# Altium schematic sheet ArduinoUnoShield.SchDoc
size A4
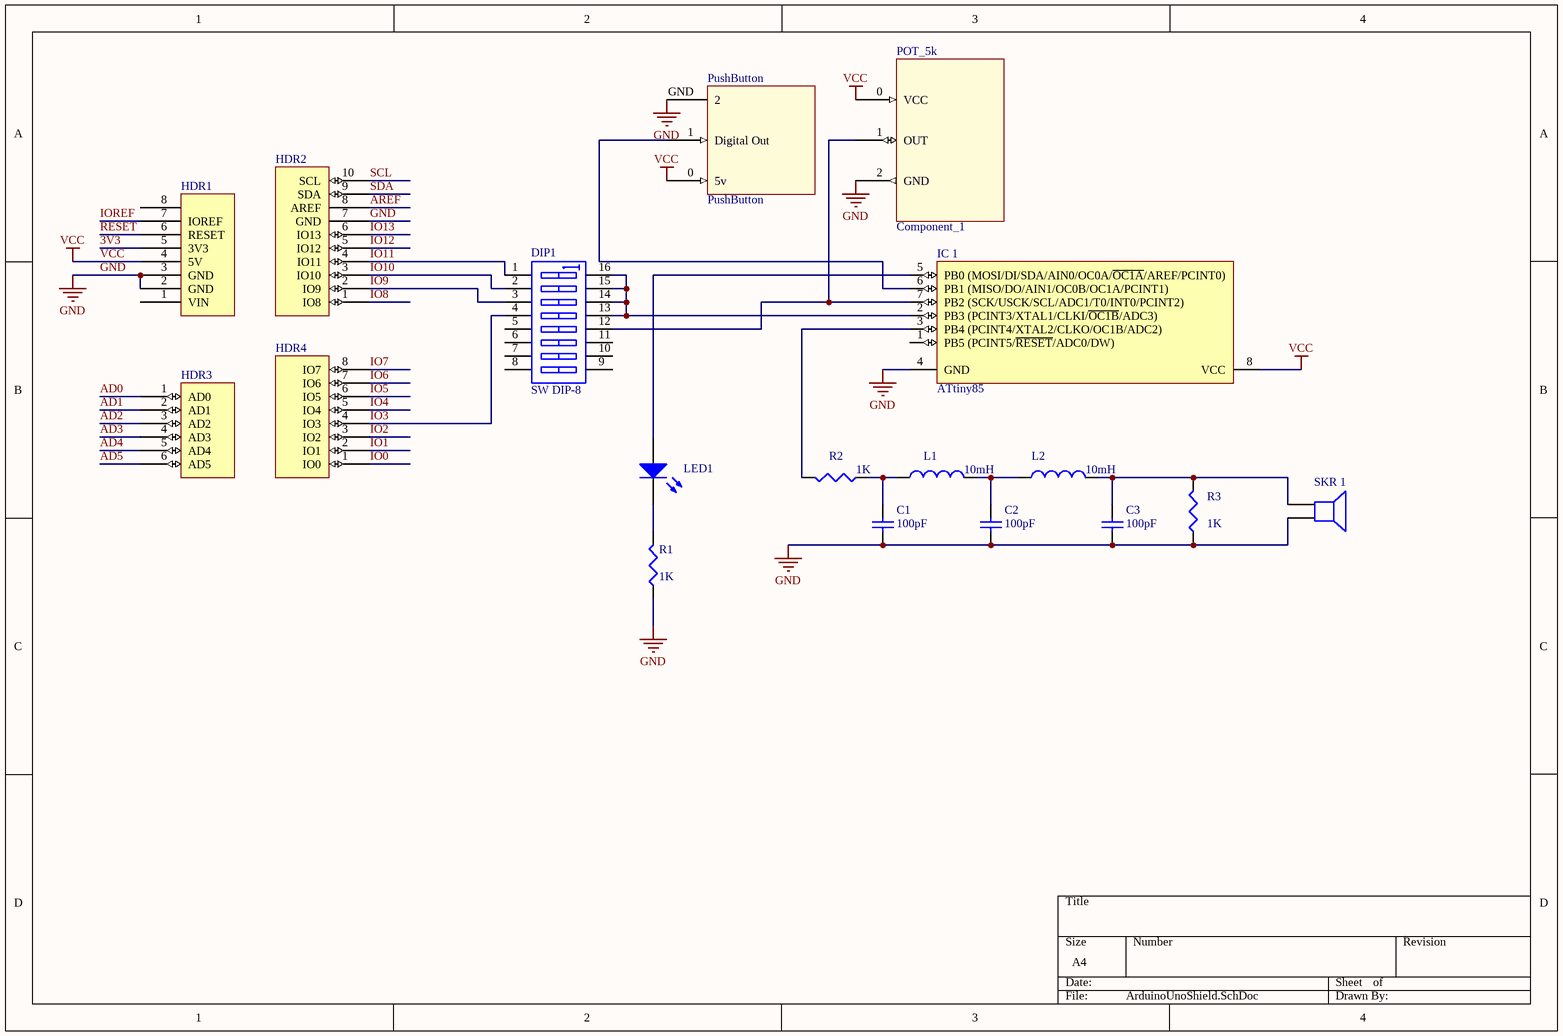
[diagram p0: ArduinoUnoShield.SchDoc]

## Parts
C1  value 100pF  [1608[0603]]  (hidden comment: Cap Semi)
C2  value 100pF  [1608[0603]]  (hidden comment: Cap Semi)
C3  value 100pF  [1608[0603]]  (hidden comment: Cap Semi)
DIP1  SW DIP-8  [DIP_SW_8WAY_SMD]
HDR1  POWER_UNO  [Header 8x1 8.5mm]  (value not drawn)
HDR2  IOH  [Header 10x1 8.5mm]  (value not drawn)
HDR3  AD  [Header 6x1 8.5mm]  (value not drawn)
HDR4  IOL  [Header 8x1 8.5mm]  (value not drawn)
IC_1  ATtiny85  [8P3]
L1  value 10mH  [0603]  (hidden comment: Inductor)
L2  value 10mH  [0603]  (hidden comment: Inductor)
LED1  LED1  [LED-1]  (value not drawn)
POT_5k  Component_1  [PCBComponent_1]
PushButton  PushButton  [PushButtonFrame]
R1  value 1K  [J1-0603]
R2  value 1K  [J1-0603]  (hidden comment: Res3)
R3  value 1K  [J1-0603]  (hidden comment: Res3)
SKR_1  Speaker  [PIN2]  (value not drawn)

## Nets
GND: C1.1 C2.1 C3.1 HDR1.2(GND) HDR1.3(GND) HDR2.7(GND) IC_1.4(GND) POT_5k.2(GND) PushButton.GND(2) R1.1 R3.1 SKR_1.2
VCC: HDR1.4(5V) IC_1.8(VCC) POT_5k.0(VCC) PushButton.0(5v)
3V3: HDR1.5(3V3)
AD0: HDR3.1(AD0)
AD1: HDR3.2(AD1)
AD2: HDR3.3(AD2)
AD3: HDR3.4(AD3)
AD4: HDR3.5(AD4)
AD5: HDR3.6(AD5)
AREF: HDR2.8(AREF)
IO0: HDR4.1(IO0)
IO1: HDR4.2(IO1)
IO2: HDR4.3(IO2)
IO3: DIP1.4(A4) HDR4.4(IO3)
IO4: HDR4.5(IO4)
IO5: HDR4.6(IO5)
IO6: HDR4.7(IO6)
IO7: HDR4.8(IO7)
IO8: HDR2.1(IO8)
IO9: DIP1.3(A3) HDR2.2(IO9)
IO10: DIP1.2(A2) HDR2.3(IO10)
IO11: DIP1.1(A1) HDR2.4(IO11)
IO12: HDR2.5(IO12)
IO13: HDR2.6(IO13)
IOREF: HDR1.7(IOREF)
RESET: HDR1.6(RESET)
SCL: HDR2.10(SCL)
SDA: HDR2.9(SDA)
NetC1_2: C1.2 L1.1 R2.1
NetC2_2: C2.2 L1.2 L2.1
NetC3_2: C3.2 L2.2 R3.2 SKR_1.1
NetDIP1_12: DIP1.12(B5) IC_1.7(PB2_(SCK/USCK/SCL/ADC1/T0/INT0/PCINT2)) POT_5k.1(OUT)
NetDIP1_13: DIP1.13(B4) DIP1.14(B3) DIP1.15(B2) DIP1.16(B1) IC_1.2(PB3_(PCINT3/XTAL1/CLKI/~{OC1B}/ADC3))
NetIC_1_3: IC_1.3(PB4_(PCINT4/XTAL2/CLKO/OC1B/ADC2)) R2.2
NetIC_1_5: IC_1.5(PB0_(MOSI/DI/SDA/AIN0/OC0A/~{OC1A}/AREF/PCINT0)) LED1.1(A)
NetIC_1_6: IC_1.6(PB1_(MISO/DO/AIN1/OC0B/OC1A/PCINT1)) PushButton.1(Digital_Out)
NetLED1_2: LED1.2(K) R1.2

Not connected (* = marked no-connect by the designer): DIP1 5(A5) 6(A6) 7(A7) 8(A8) 9(B8) 10(B7) 11(B6); HDR1 1(VIN) 8; IC_1 1(PB5_(PCINT5/~{RESET}/ADC0/DW))

## Library data of the parts
C1-C3 = Cap Semi: Capacitor (Semiconductor SIM Model); Published: 8-Jun-2000; LatestRevisionDate: 29-May-2009; LatestRevisionNote: IPC-7351 Footprint Added.; PackageReference: C1206; Publisher: Altium Limited; PackageDescription: Chip Capacitor
DIP1 = SW DIP-8: DIP Switch, 8 Position, SPST; Published: 24-Mar-1999; LatestRevisionDate: 17-Jul-2002; LatestRevisionNote: Re-released for DXP Platform.; PackageReference: DIP_SW_8WAY_SMD; Publisher: Altium Limited; PackageDescription: DIP Switch; 16 Leads
IC_1 = ATtiny85-20PU: Low Power tinyAVR® 8-Bit Microcontroller, 8K Flash Memory, 20MHz, Industrial Temperature, 8-Lead PDIP, Pb-Free; Published: 20-Nov-2009; DatasheetVersion: DOC2586I, May-2008; PackageVersion: revB, Jan-2002; PackageReference: 8P3; Publisher: Altium Limited; PackageDescription: 8-Lead, 0.300" Wide Body, Plastic Dual In-Line Package (PDIP); Supplier 1: Digi-Key; Supplier Part Number 1: ATTINY85-20PU-ND; Supplier 2: Farnell; Supplier Part Number 2: 1455162; Supplier 3: Mouser; Supplier Part Number 3: 556-ATTINY85-20PU; Code_JEDEC: MS-001-BA; ComponentLink1Description: Manufacturer Link; ComponentLink1URL: http://www.atmel.com/products/AVR/tinyavr.asp?; ComponentLink2Description: Datasheet; ComponentLink2URL: http://www.atmel.com/dyn/resources/prod_documents/doc2586.pdf; ComponentLink3Description: Atmel.com Home; ComponentLink3URL: http://www.atmel.com
L1 L2 = Inductor: Code_IEC: 1005; Published: 8-Jun-2000; LatestRevisionDate: 29-May-2009; LatestRevisionNote: IPC-7351 Footprint Added.; PackageReference: 0402-A; Publisher: Altium Limited; PackageDescription: Chip Inductor; Code_JEITA: 0402
LED1 = LED1: Typical RED GaAs LED; Published: 8-Jun-2000; LatestRevisionDate: 08-Jul-2005; LatestRevisionNote: Mech Layer 1 removed.; PackageReference: LED-1; Publisher: Altium Limited; PackageDescription: LED; 2 Leads
POT_5k = Component_1: 5k RES
R1-R3 = Res3: Resistor; Published: 8-Jun-2000; LatestRevisionDate: 29-May-2009; LatestRevisionNote: IPC-7351 Footprint Added.; PackageReference: J1-0603; Publisher: Altium Limited; PackageDescription: Chip Resistor
SKR_1 = Speaker: Loudspeaker; Published: 24-Mar-1999; LatestRevisionDate: 17-Jul-2002; LatestRevisionNote: Re-released for DXP Platform.; PackageReference: PIN2; Publisher: Altium Limited
HDR1 = POWER_UNO: Supplier 1: Digi-Key; Supplier Part Number 1: SAM1198-08-ND; Supplier 2: Arrow; Supplier Part Number 2: 2698939; Supplier 3: Arrow; Supplier Part Number 3: 2698940; Supplier 4: Arrow; Supplier Part Number 4: 2698925
HDR2 = IOH: Supplier 1: Arrow; Supplier Part Number 1: 2698803S4475693N1004; Supplier 2: Digi-Key; Supplier Part Number 2: SAM1198-10-ND; Supplier 3: Arrow; Supplier Part Number 3: 2698789
HDR3 = AD: Supplier 1: Arrow; Supplier Part Number 1: 2699089; Supplier 2: Digi-Key; Supplier Part Number 2: SAM1198-06-ND; Supplier 3: Arrow; Supplier Part Number 3: 2699088; Supplier 4: Arrow; Supplier Part Number 4: 2699075
HDR4 = IOL: Supplier 1: Digi-Key; Supplier Part Number 1: SAM1198-08-ND; Supplier 2: Arrow; Supplier Part Number 2: 2698939; Supplier 3: Arrow; Supplier Part Number 3: 2698940; Supplier 4: Arrow; Supplier Part Number 4: 2698925